# EAGLE board TEC-BVr2 (EAGLE 9.6.2)
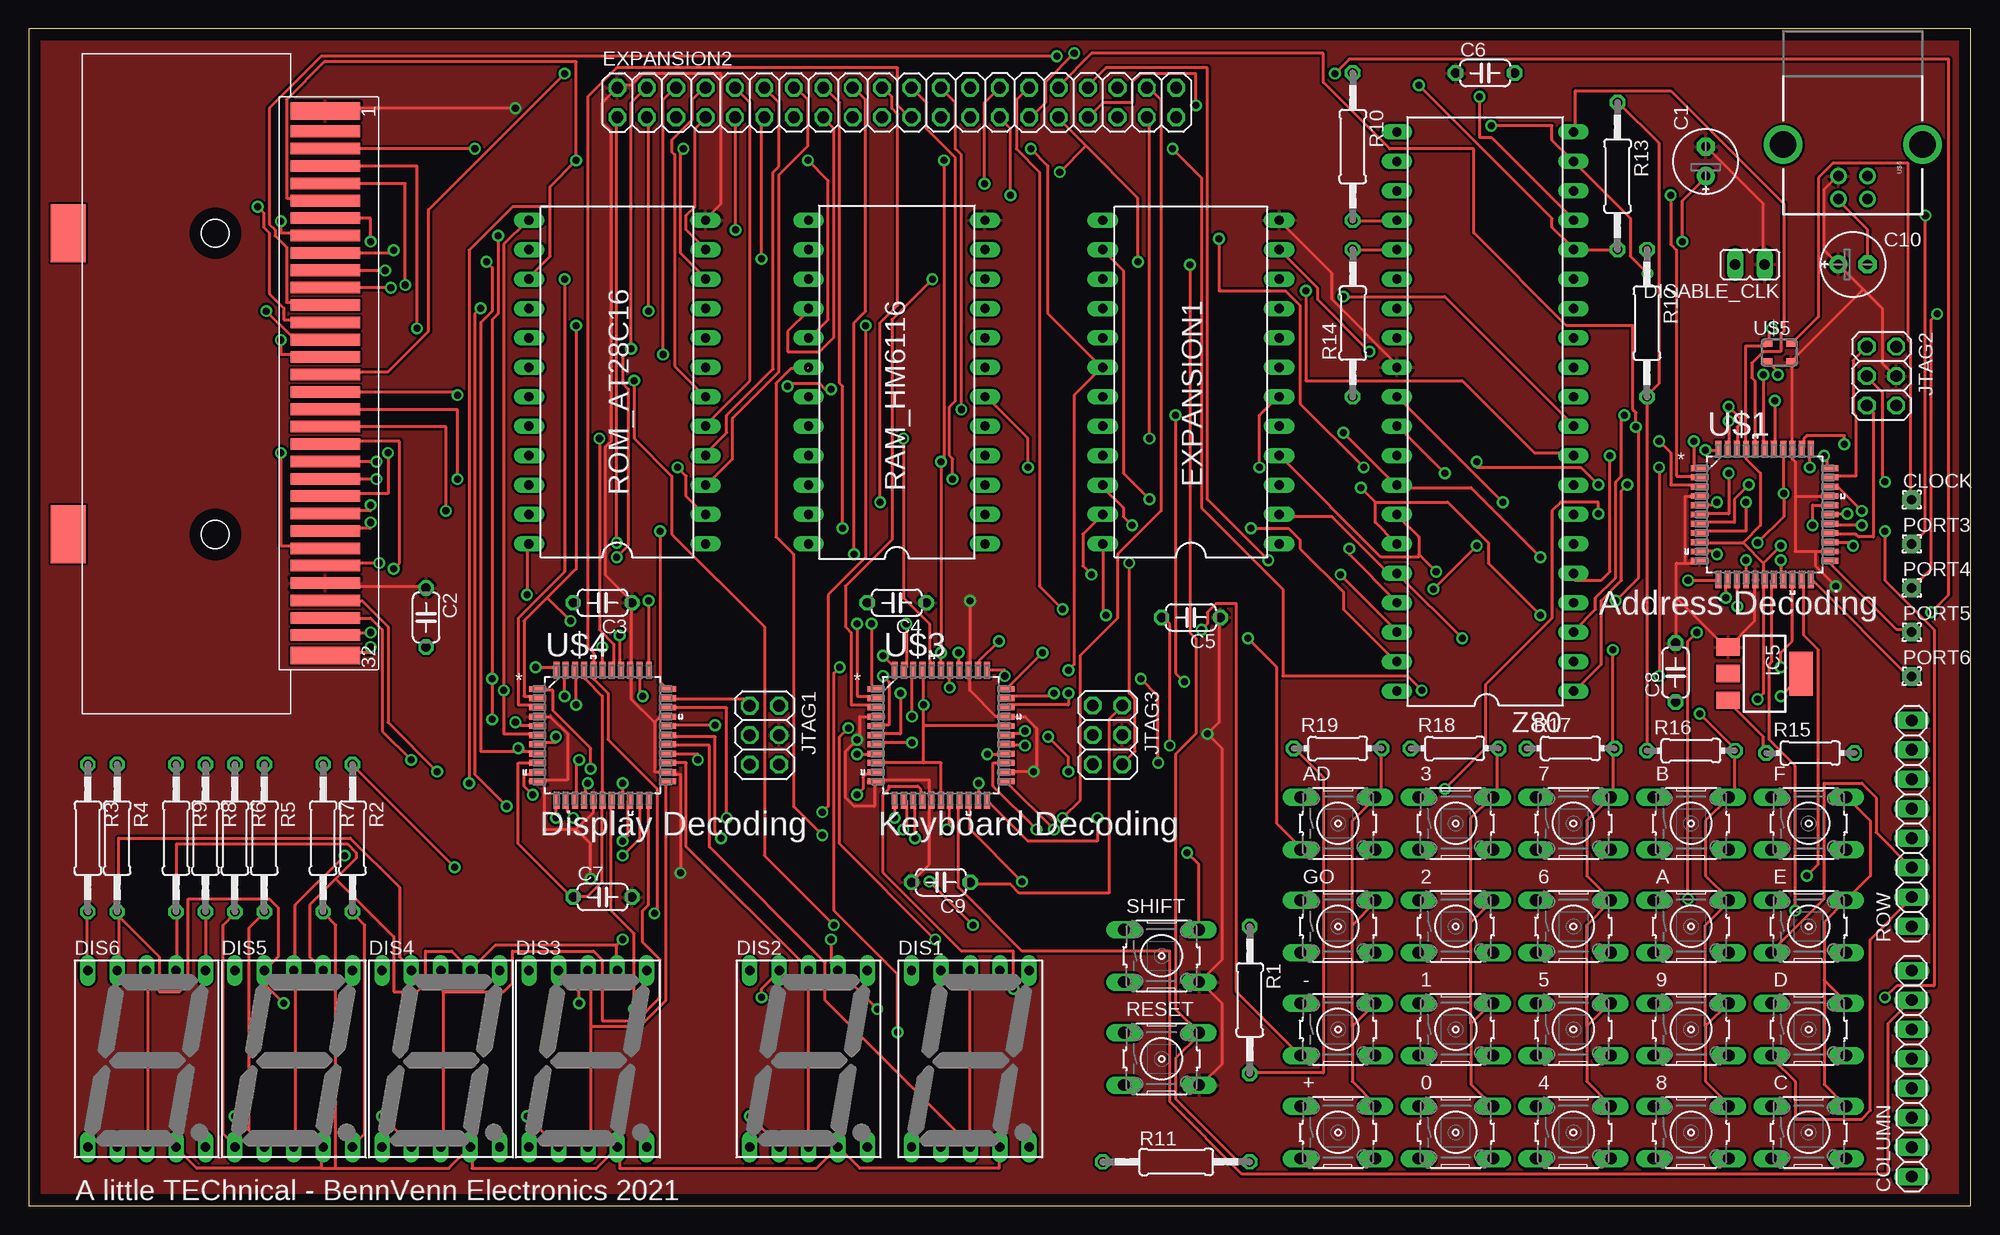
[diagram p2: board, top side]
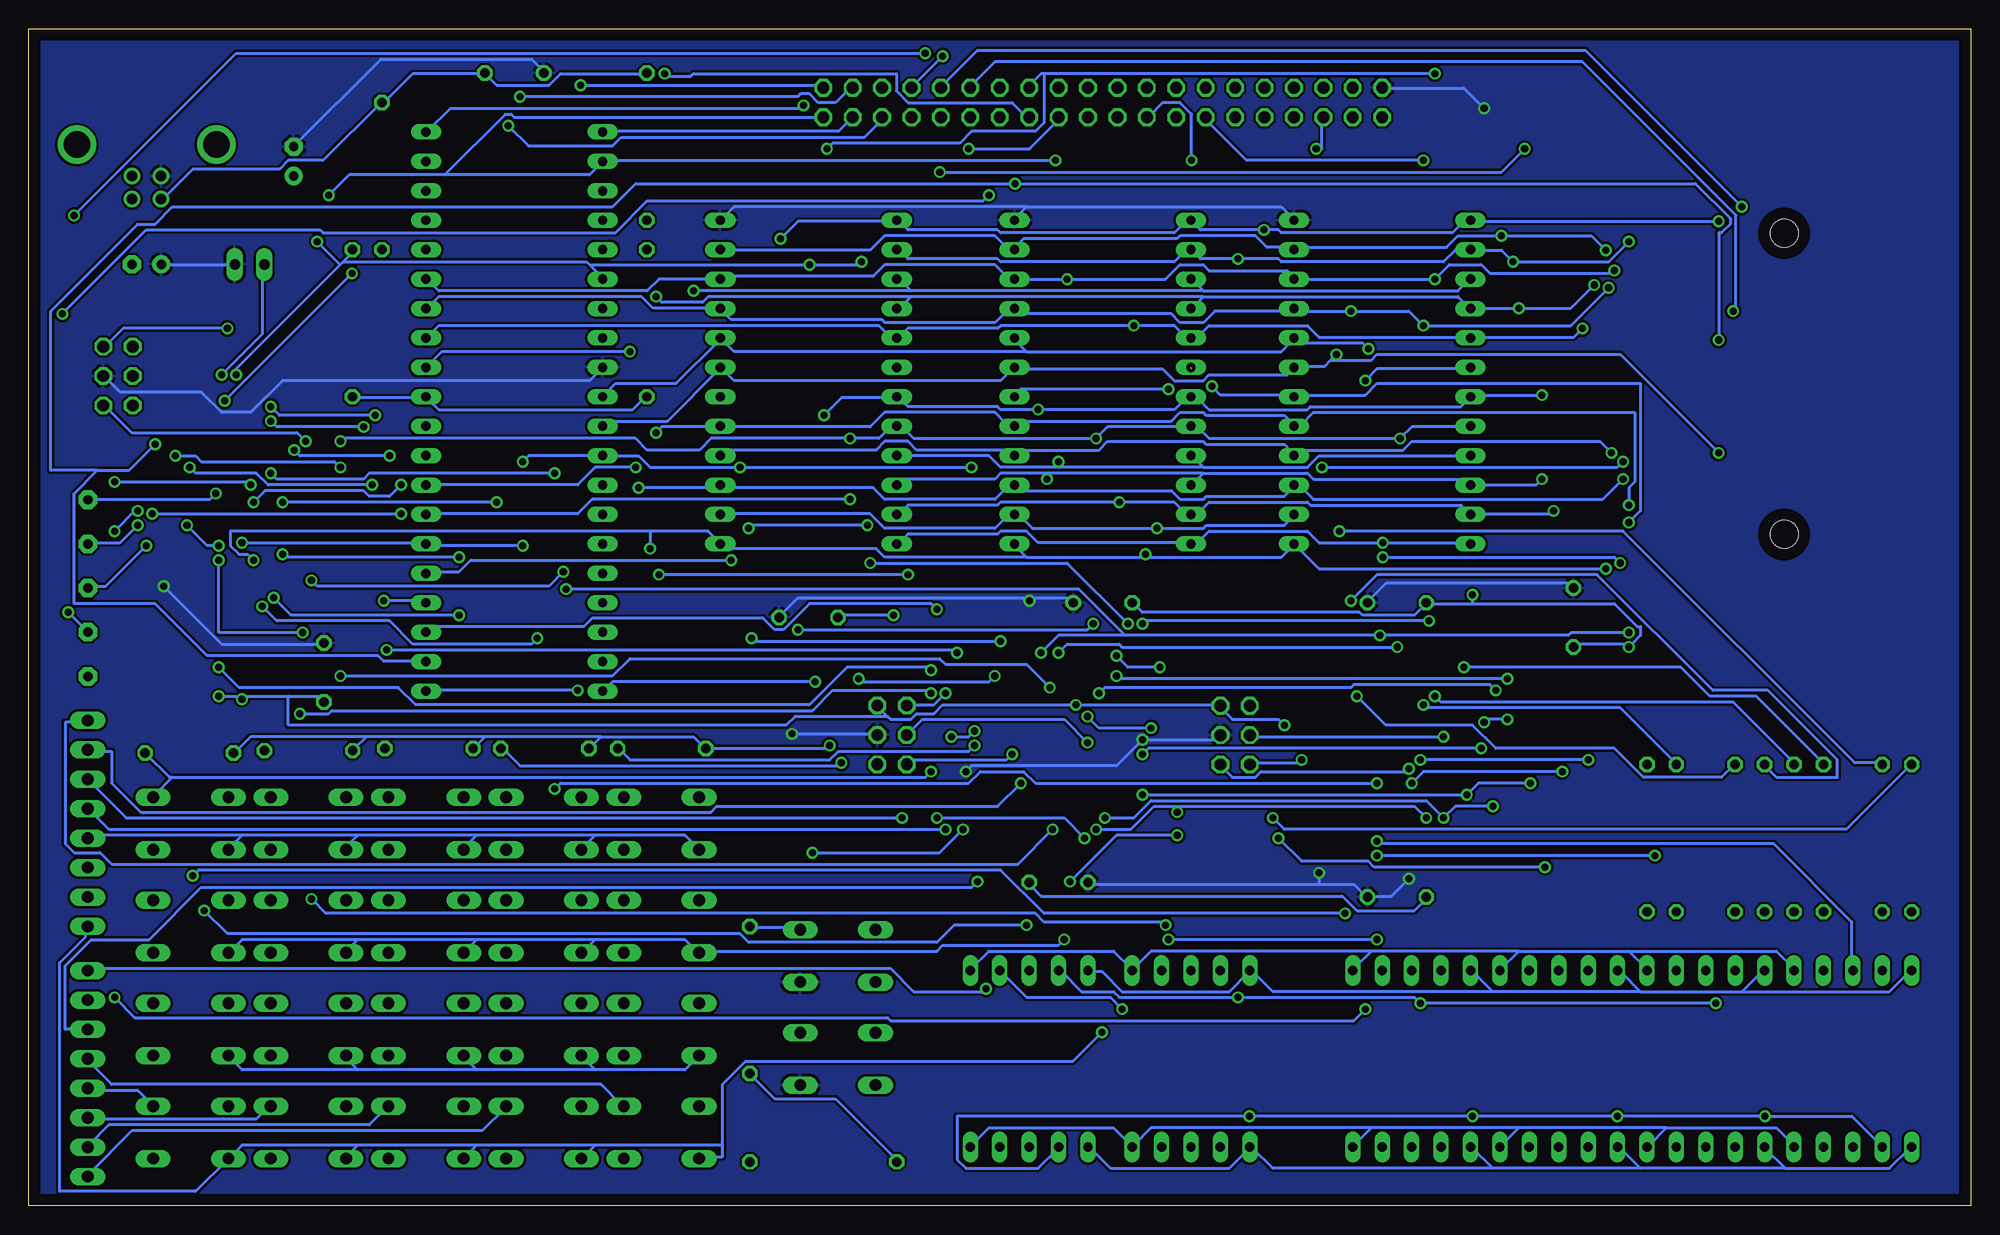
[diagram p3: board, bottom side, seen from below]

Size 167.64 x 101.6 mm. Coordinates in mm from the lower left corner, seen from the top.
Outline: 0,0 167.64,0 167.64,101.6 0,101.6 0,0
Copper layers (1*16): Top 0.035mm / dielectric 1.5mm / Bottom 0.035mm
Design rules "default *": minimum track width 10mil, minimum drill 24mil, track to track 8mil, track to pad 8mil, pad to pad 8mil, via to via 8mil, smd to smd 8mil, copper to edge 40mil, drill to drill 8mil, minimum pad ring 10mil, minimum via ring 8mil, stop-mask expansion 4mil, vias tented up to drill 50mil, thermal gap 10mil

## Footprints (pad centres in the part's own frame; a part is rotated, then mirrored left to right if it is on the bottom)
B3F-10XX = drill 1.016 long: 1 -3.251,2.261; 2 3.251,2.261; 3 -3.251,-2.261; 4 3.251,-2.261
E2,5-6E = drill 0.813 pad 1.575: + -1.27,0 | drill 0.813 pad 1.575 octagon: - 1.27,0
C050-024X044 = drill 0.813 octagon: 1 -2.54,0; 2 2.54,0
1,6/0,8 = drill 0.813 pad 1.6 octagon: 1 0,0
1X08 = drill 1.016 long: 1 -8.89,0; 2 -6.35,0; 3 -3.81,0; 4 -1.27,0; 5 1.27,0; 6 3.81,0; 7 6.35,0; 8 8.89,0
HDSP-M = drill 0.813 long: 1 -5.08,-7.62; 2 -2.54,-7.62; 3 0,-7.62; 4 2.54,-7.62; 5 5.08,-7.62; 6 5.08,7.62; 7 2.54,7.62; 8 0,7.62; 9 -2.54,7.62; 10 -5.08,7.62
JP1 = drill 0.914 long: 1 0,-1.27; 2 0,1.27
DIL24-6 = drill 0.813 long: 1 -13.97,-7.62; 2 -11.43,-7.62; 3 -8.89,-7.62; 4 -6.35,-7.62; 5 -3.81,-7.62; 6 -1.27,-7.62; 7 1.27,-7.62; 8 3.81,-7.62; 9 6.35,-7.62; 10 8.89,-7.62; 11 11.43,-7.62; 12 13.97,-7.62; 13 13.97,7.62; 14 11.43,7.62; 15 8.89,7.62; 16 6.35,7.62; 17 3.81,7.62; 18 1.27,7.62; 19 -1.27,7.62; 20 -3.81,7.62; 21 -6.35,7.62; 22 -8.89,7.62; 23 -11.43,7.62; 24 -13.97,7.62
2X20 = drill 1.016 octagon: 1 -24.13,-1.27; 2 -24.13,1.27; 3 -21.59,-1.27; 4 -21.59,1.27; 5 -19.05,-1.27; 6 -19.05,1.27; 7 -16.51,-1.27; 8 -16.51,1.27; 9 -13.97,-1.27; 10 -13.97,1.27; 11 -11.43,-1.27; 12 -11.43,1.27; 13 -8.89,-1.27; 14 -8.89,1.27; 15 -6.35,-1.27; 16 -6.35,1.27; 17 -3.81,-1.27; 18 -3.81,1.27; 19 -1.27,-1.27; 20 -1.27,1.27; 21 1.27,-1.27; 22 1.27,1.27; 23 3.81,-1.27; 24 3.81,1.27; 25 6.35,-1.27; 26 6.35,1.27; 27 8.89,-1.27; 28 8.89,1.27; 29 11.43,-1.27; 30 11.43,1.27; 31 13.97,-1.27; 32 13.97,1.27; 33 16.51,-1.27; 34 16.51,1.27; 35 19.05,-1.27; 36 19.05,1.27; 37 21.59,-1.27; 38 21.59,1.27; 39 24.13,-1.27; 40 24.13,1.27
SOT223 = smd 1.5 x 2: 1 -2.3,-3.15; 2 0,-3.15; 3 2.3,-3.15 | smd 3.8 x 2: 4 0,3.15
2X03 = drill 1.016 octagon: 1 -2.54,-1.27; 2 -2.54,1.27; 3 0,-1.27; 4 0,1.27; 5 2.54,-1.27; 6 2.54,1.27
0207/12 = drill 0.813 octagon: 1 -6.35,0; 2 6.35,0
0204/7 = drill 0.813 octagon: 1 -3.81,0; 2 3.81,0
DIL24 = drill 0.813 long: 1 -13.97,-7.62; 2 -11.43,-7.62; 3 -8.89,-7.62; 4 -6.35,-7.62; 5 -3.81,-7.62; 6 -1.27,-7.62; 7 1.27,-7.62; 8 3.81,-7.62; 9 6.35,-7.62; 10 8.89,-7.62; 11 11.43,-7.62; 12 13.97,-7.62; 13 13.97,7.62; 14 11.43,7.62; 15 8.89,7.62; 16 6.35,7.62; 17 3.81,7.62; 18 1.27,7.62; 19 -1.27,7.62; 20 -3.81,7.62; 21 -6.35,7.62; 22 -8.89,7.62; 23 -11.43,7.62; 24 -13.97,7.62
QFP80P1200X1200X120-44N = smd 1.473 x 0.508: 1 -5.613,3.988; 2 -5.613,3.2; 3 -5.613,2.388; 4 -5.613,1.6; 5 -5.613,0.787; 6 -5.613,0; 7 -5.613,-0.787; 8 -5.613,-1.6; 9 -5.613,-2.388; 10 -5.613,-3.2; 11 -5.613,-3.988; 23 5.613,-3.988; 24 5.613,-3.2; 25 5.613,-2.388; 26 5.613,-1.6; 27 5.613,-0.787; 28 5.613,0; 29 5.613,0.787; 30 5.613,1.6; 31 5.613,2.388; 32 5.613,3.2; 33 5.613,3.988 | smd 0.508 x 1.473: 12 -3.988,-5.613; 13 -3.2,-5.613; 14 -2.388,-5.613; 15 -1.6,-5.613; 16 -0.787,-5.613; 17 0,-5.613; 18 0.787,-5.613; 19 1.6,-5.613; 20 2.388,-5.613; 21 3.2,-5.613; 22 3.988,-5.613; 34 3.988,5.613; 35 3.2,5.613; 36 2.388,5.613; 37 1.6,5.613; 38 0.787,5.613; 39 0,5.613; 40 -0.787,5.613; 41 -1.6,5.613; 42 -2.388,5.613; 43 -3.2,5.613; 44 -3.988,5.613
GB_CON32 = smd 1.5 x 6: 1 2,4; 32 49,4 | smd 1 x 6: 2 3.75,4; 3 5.25,4; 4 6.75,4; 5 8.25,4; 6 9.75,4; 7 11.25,4; 8 12.75,4; 9 14.25,4; 10 15.75,4; 11 17.25,4; 12 18.75,4; 13 20.25,4; 14 21.75,4; 15 23.25,4; 16 24.75,4; 17 26.25,4; 18 27.75,4; 19 29.25,4; 20 30.75,4; 21 32.25,4; 22 33.75,4; 23 35.25,4; 24 36.75,4; 25 38.25,4; 26 39.75,4; 27 41.25,4; 28 42.75,4; 29 44.25,4; 30 45.75,4; 31 47.25,4 | smd 5 x 3: P$1 12.55,-18.2; P$2 38.55,-18.2 | hole 2.4: 12.55,-5.5; 38.55,-5.5
ASE = smd 0.9 x 0.65: 1 -1.05,-0.825; 2 1.05,-0.825; 3 1.05,0.825; 4 -1.05,0.825
USB_B_PTH = drill 0.914: D+ 0,1.25; D- 1.981,1.25; GND 0,-1.25; VBUS 1.981,-1.25 | drill 2.286: P$1 -2.718,-6.02; P$2 -2.718,6.02
DIL40 = drill 0.813 long: 1 -24.13,-7.62; 2 -21.59,-7.62; 3 -19.05,-7.62; 4 -16.51,-7.62; 5 -13.97,-7.62; 6 -11.43,-7.62; 7 -8.89,-7.62; 8 -6.35,-7.62; 9 -3.81,-7.62; 10 -1.27,-7.62; 11 1.27,-7.62; 12 3.81,-7.62; 13 6.35,-7.62; 14 8.89,-7.62; 15 11.43,-7.62; 16 13.97,-7.62; 17 16.51,-7.62; 18 19.05,-7.62; 19 21.59,-7.62; 20 24.13,-7.62; 21 24.13,7.62; 22 21.59,7.62; 23 19.05,7.62; 24 16.51,7.62; 25 13.97,7.62; 26 11.43,7.62; 27 8.89,7.62; 28 6.35,7.62; 29 3.81,7.62; 30 1.27,7.62; 31 -1.27,7.62; 32 -3.81,7.62; 33 -6.35,7.62; 34 -8.89,7.62; 35 -11.43,7.62; 36 -13.97,7.62; 37 -16.51,7.62; 38 -19.05,7.62; 39 -21.59,7.62; 40 -24.13,7.62

## Placement (x,y rotation side)
0  [B3F-10XX]  123.19,6.35 0 top
1  [B3F-10XX]  123.19,15.24 0 top
2  [B3F-10XX]  123.19,24.13 0 top
3  [B3F-10XX]  123.19,33.02 0 top
4  [B3F-10XX]  133.35,6.35 0 top
5  [B3F-10XX]  133.35,15.24 0 top
6  [B3F-10XX]  133.35,24.13 0 top
7  [B3F-10XX]  133.35,33.02 0 top
8  [B3F-10XX]  143.51,6.35 0 top
9  [B3F-10XX]  143.51,15.24 0 top
+  [B3F-10XX]  113.03,6.35 0 top
-  [B3F-10XX]  113.03,15.24 0 top
A  [B3F-10XX]  143.51,24.13 0 top
AD  [B3F-10XX]  113.03,33.02 0 top
B  [B3F-10XX]  143.51,33.02 0 top
C  [B3F-10XX]  153.67,6.35 0 top
C1  [E2,5-6E]  144.78,90.17 90 top
C2  [C050-024X044]  34.29,50.8 270 top
C3  [C050-024X044]  49.53,52.07 180 top
C4  [C050-024X044]  74.93,52.07 180 top
C5  [C050-024X044]  100.33,50.8 180 top
C6  [C050-024X044]  125.73,97.79 0 top
C7  [C050-024X044]  49.53,26.67 0 top
C8  [C050-024X044]  142.17,46.05 90 top
C9  [C050-024X044]  78.74,27.94 180 top
C10  [E2,5-6E]  157.48,81.28 0 top
CLOCK  [1,6/0,8]  162.56,60.96 0 top
COLUMN  [1X08]  162.56,11.43 90 top
D  [B3F-10XX]  153.67,15.24 0 top
DIS1  HD-H103  [HDSP-M]  81.28,12.7 0 top
DIS2  HD-H103  [HDSP-M]  67.31,12.7 0 top
DIS3  HD-H103  [HDSP-M]  48.26,12.7 0 top
DIS4  HD-H103  [HDSP-M]  35.56,12.7 0 top
DIS5  HD-H103  [HDSP-M]  22.86,12.7 0 top
DIS6  HD-H103  [HDSP-M]  10.16,12.7 0 top
DISABLE_CLK  [JP1]  148.59,81.28 90 top
E  [B3F-10XX]  153.67,24.13 0 top
EXPANSION1  [DIL24-6]  100.33,71.12 90 top
EXPANSION2  [2X20]  74.93,95.25 0 top
F  [B3F-10XX]  153.67,33.02 0 top
GO  [B3F-10XX]  113.03,24.13 0 top
IC5  LD117AS33TR  [SOT223]  149.86,45.95 270 top
JTAG1  [2X03]  63.5,40.64 270 top
JTAG2  [2X03]  159.95,71.64 270 top
JTAG3  [2X03]  93.12,40.66 270 top
PORT3  [1,6/0,8]  162.56,57.15 0 top
PORT4  [1,6/0,8]  162.56,53.34 0 top
PORT5  [1,6/0,8]  162.56,49.53 0 top
PORT6  [1,6/0,8]  162.56,45.72 0 top
R1  [0207/12]  105.41,17.78 270 top
R2  [0207/12]  27.94,31.75 270 top
R3  [0207/12]  5.08,31.75 270 top
R4  [0207/12]  7.62,31.75 270 top
R5  [0207/12]  20.32,31.75 270 top
R6  [0207/12]  17.78,31.75 270 top
R7  [0207/12]  25.4,31.75 270 top
R8  [0207/12]  15.24,31.75 270 top
R9  [0207/12]  12.7,31.75 270 top
R10  [0207/12]  114.3,91.44 270 top
R11  [0207/12]  99.06,3.81 0 top
R12  [0207/12]  139.7,76.2 270 top
R13  [0207/12]  137.16,88.9 270 top
R14  [0207/12]  114.3,76.2 90 top
R15  [0204/7]  153.8,39.1 0 top
R16  [0204/7]  143.5,39.3 0 top
R17  [0204/7]  133.1,39.5 0 top
R18  [0204/7]  123.1,39.5 0 top
R19  [0204/7]  113,39.5 0 top
RAM_HM6116  [DIL24]  74.93,71.12 90 top
RESET  [B3F-10XX]  97.79,12.7 0 top
ROM_AT28C16  [DIL24-6]  50.8,71.12 90 top
ROW  [1X08]  162.56,33.02 90 top
SHIFT  [B3F-10XX]  97.79,21.59 0 top
U$1  Address Decoding  [QFP80P1200X1200X120-44N]  149.86,59.69 0 top
U$2  GBCON32FLIP  [GB_CON32]  21.59,96.52 270 top
U$3  Keyboard Decoding  [QFP80P1200X1200X120-44N]  78.74,40.64 0 top
U$4  Display Decoding  [QFP80P1200X1200X120-44N]  49.53,40.64 0 top
U$5  ASE  [ASE]  151.13,73.66 0 top
U$6  USB  [USB_B_PTH]  157.48,88.9 270 top
Z80  [DIL40]  125.73,68.58 90 top

## Tracks (layer width: path | path; a pad name or v marks a point on that pad's centre or on a via)
3V3  (via drill 0.61)
  Top 0.254: v151.25,44 153,45.75 IC5.4 | 149.75,55.5 149.75,54.25 U$1.17 149.75,54 149.75,44.25 v149.25,43.75 | 148,57.25 149.75,55.5 | 148,57.25 144.25,57.25 U$1.9 | v154,58.75 154,60.5 155.25,60.5 U$1.29 | 149.75,55.5 v151.25,57 | v150.5,75.75 150.25,75.5 150.25,74.5 U$5.4 150,74.25 148.25,74.25 148.25,65.5 U$1.41 148.25,65.25 148.25,64.5 149.5,63.25 149.5,58.75 148,57.25 | U$4.41 48,46.25 48,45.5 49.5,44 49.5,35.25 U$4.17 49.5,35 49.5,28 48.25,26.75 47,26.75 C7.1 46.75,26.75 42.25,31.25 42.25,38.25 43.75,38.25 U$4.9 | 77.25,38.25 78.75,38.25 78.75,35.25 U$3.17 | 77.25,38.25 73.25,38.25 U$3.9 | 77.25,38.25 77.25,41.5 | 77.25,41.5 v77.25,43.25 77.25,46.25 U$3.41 | 77.25,41.5 84.25,41.5 U$3.29 | v59.25,41.5 55.25,41.5 U$4.29 | C9.1 81.5,27.75 84.75,27.75 85.5,27 93.25,27 93.25,42 94.25,43 JTAG3.2
  Bottom 0.254: v151.25,44 149.25,44 | 149.25,44 145.25,44 | 145.25,44 142.5,44 142.25,43.75 C8.1 | v154,58.75 152.25,57 v151.25,57 | v150.5,75.75 159.5,75.75 161,74.25 JTAG2.2 | v149.25,43.75 149.25,44 | v59.25,41.5 59.75,42 63.75,42 64.75,43 JTAG1.2 65,43.25 v77.25,43.25 88.75,43.25 89.5,42.5 91,42.5 91.5,42 93.25,42 93.5,42.25 | 93.5,42.25 94.25,43 JTAG3.2 | C7.1 47,26.5 48,25.5 53,25.5 54.25,26.75 80.25,26.75 81.25,27.75 C9.1 | 145.25,44 145.25,41.5 102.25,41.5 101.5,42.25 93.5,42.25
!INT  (via drill 0.61)
  Top 0.254: R13.2 137,82.5 133.5,82.5 Z80.16 133.25,82.75 131.5,84.5 131.5,85.25 v120,96.75
  Bottom 0.254: v120,96.75 99.25,96.75 EXPANSION2.40
!RD  (via drill 0.61)
  Top 0.254: v49.25,66.25 49.25,49.75 50.5,48.5 50.5,46.5 U$4.38 | v75.5,66.25 75.5,52.5 77.75,50.25 77.75,46.5 U$3.40 | v140.75,66 141.75,65 141.75,62.25 144,62.25 U$1.3 | v96.75,66.25 96.75,93.75 EXPANSION2.37
  Bottom 0.254: ROM_AT28C16.20 43.25,67.25 48.25,67.25 v49.25,66.25 65.75,66.25 66.75,67.25 67.25,67.25 RAM_HM6116.20 67.5,67.25 74.5,67.25 v75.5,66.25 91.25,66.25 92.25,67.25 92.5,67.25 EXPANSION1.20 92.75,67.25 93.25,67.25 94.25,66.25 v96.75,66.25 108.75,66.25 109.75,65.25 114.25,65.25 115.25,66.25 140.5,66.25 v140.75,66 | EXPANSION2.37 97.75,92.75 118,92.75 Z80.21
!RESET  (via drill 0.61)
  Top 0.254: R11.2 105.25,4 104.25,4 99,9.25 99,12.75 101,14.75 RESET.2 101,15 99,17 99,39 100.75,40.75 100.75,49 100.25,49.5 v100.25,81.25 | v149.75,71.75 149.75,65.5 U$1.39 | 91.25,91.5 95.75,87 v95.75,81.5 | 91.25,91.5 89,93.75 EXPANSION2.31 | v142.75,83.25 142.75,86.75 144.75,88.75 C1.+ | v38.5,91.25 25.75,91.25 U$2.3 | 91.25,91.5 v89,89.25
  Bottom 0.254: v149.75,71.75 149.75,72.25 140.75,81.25 | 140.5,81.5 139.5,82.5 R12.1 | 140.5,81.5 140.75,81.25 | 119.25,81.25 119.5,81.5 140.5,81.5 | 119.25,81.25 118.25,80.25 Z80.26 | v95.75,81.5 96,81.25 v100.25,81.25 119.25,81.25 | 140.75,81.25 v142.75,83.25 | v38.5,91.25 40.5,89.25 v89,89.25
!WR  (via drill 0.61)
  Top 0.254: v49.5,48.25 49.5,46.5 U$4.39 | U$3.39 78.75,46.5 v78.75,47.75 v78.75,64.25 79,64.5 v79,90.25 | v141.75,87.25 141.75,83 142.25,82.5 142.25,63 144,63 U$1.2
  Bottom 0.254: v49.5,48.25 73.25,48.25 73.5,48.5 78,48.5 v78.75,47.75 | 66.25,63.75 57.25,63.75 56.25,64.75 43.25,64.75 ROM_AT28C16.21 | 66.25,63.75 67.25,64.75 RAM_HM6116.21 | 66.25,63.75 78.75,63.75 | 78.75,63.75 83.75,63.75 84.75,64.75 92.5,64.75 EXPANSION1.21 | 78.75,63.75 v78.75,64.25 | v141.75,87.25 140,89 131.75,89 | 131.75,89 119.25,89 118.25,90 Z80.22 118,90.25 v79,90.25 | 131.75,89 126.5,94.25 126,94.25 125.75,94 99.25,94 EXPANSION2.39
A  (via drill 0.61)
  Top 0.254: v73.25,17 70,20.25 DIS2.7 69.75,20.5 69.25,21 v69.25,23 | 50.75,22.5 40.25,22.5 38.25,20.5 DIS4.7 38,20.5 36.5,22 34.25,22 34.25,19.25 33.5,18.5 31.5,18.5 31.5,23.25 26.5,28.25 | 50.75,22.5 50.75,20.5 DIS3.7 | DIS6.7 12.75,20.5 12.75,25.25 R9.2 12.75,25.5 12.75,31.25 27.5,31.25 28.25,30.5 28.25,30 26.5,28.25 | 26.5,28.25 24.25,26 24.25,21.5 25.25,20.5 DIS5.7 | 50.75,22.5 v51.25,23
  Bottom 0.254: v73.25,17 74.25,18 81.5,18 DIS1.7 | v51.25,23 v69.25,23
A0  (via drill 0.61)
  Top 0.254: v145.75,60.75 145.75,60.5 144.25,60.5 U$1.5 | v127.25,60.75 118.25,69.75 Z80.30 | EXPANSION2.4 53.25,96.5 52,95.25 v52,74 51.25,73.25 51.25,71 51.75,70.5 51.75,57 v50.75,56 | v30.25,55.5 25.75,55.5 U$2.27
  Bottom 0.254: v127.25,60.75 v145.75,60.75 | Z80.30 118,70 117,71 111.75,71 108,74.75 EXPANSION1.8 107.75,74.75 106.75,73.75 81.5,73.75 | 58.75,74.5 59.5,73.75 81.5,73.75 | 58.75,74.5 58.5,74.75 ROM_AT28C16.8 58.75,74.5 | 81.5,73.75 82.5,74.75 RAM_HM6116.8 | v52,74 52.5,74.5 58.75,74.5 | v30.25,55.5 30.75,56 v50.75,56
A1  (via drill 0.61)
  Top 0.254: v146.75,63.25 146.75,59.75 144.25,59.75 U$1.6 | v122.25,63.25 118.25,67.25 Z80.31 | v54.75,73.5 54.75,95.5 55.75,96.5 EXPANSION2.6 | v21.75,65 21.75,57 25.5,57 U$2.26
  Bottom 0.254: v146.75,63.25 146.25,62.75 138.75,62.75 138.25,63.25 v122.25,63.25 | Z80.31 118,67.5 117.75,67.75 112.5,67.75 108,72.25 EXPANSION1.7 107.75,72.25 106.75,71.25 83.75,71.25 82.75,72.25 RAM_HM6116.7 82.5,72.25 69.75,72.25 68.75,71.25 66.25,71.25 65.75,71.75 59,71.75 58.5,72.25 ROM_AT28C16.7 58.25,72.5 55.75,72.5 55.25,73 | 55.25,73 v54.75,73.5 | v21.75,65 30.25,73.5 51.25,73.5 51.75,73 55.25,73
A2  (via drill 0.61)
  Top 0.254: v148.25,60.75 148.25,58.25 144.25,58.25 U$1.8 | v135.5,62.25 134,63.75 125,63.75 v125,64.25 | v86.25,63.75 86.25,66.25 82.75,69.75 RAM_HM6116.6 | v106.25,63.75 106.25,68.25 107.75,69.75 EXPANSION1.6 | ROM_AT28C16.6 58.25,70 55.75,72.5 55.75,90.75 55.5,91 55.5,92 57.25,93.75 57.25,95.5 58.25,96.5 EXPANSION2.8 | v29.5,59 29.5,58.5 25.75,58.5 U$2.25 | v69.25,70.5 68.75,70.5 68.25,71 65.5,71 v65.5,70.75
  Bottom 0.254: v148.25,60.75 147.25,61.75 138.75,61.75 138.25,61.25 136.5,61.25 v135.5,62.25 | v125,64.25 124.5,64.75 118.25,64.75 Z80.32 118,64.75 115,64.75 114,63.75 v106.25,63.75 v86.25,63.75 | v29.5,59 28.5,60 28.5,71 51.25,71 52.25,70 58.25,70 ROM_AT28C16.6 58.5,70 64.75,70 v65.5,70.75 | v69.25,70.5 82,70.5 82.5,70 RAM_HM6116.6
A3  (via drill 0.61)
  Top 0.254: v145.75,56.25 145.75,56.5 U$1.10 | v130.5,56 124.5,62 118.25,62 Z80.33 118,62.25 v113.5,66.75 | EXPANSION2.10 61,96.5 62.25,95.25 62.25,71.25 58.5,67.5 ROM_AT28C16.5 | v29.5,60.5 29.5,60 25.75,60 U$2.24
  Bottom 0.254: v145.75,56.25 145.5,56 v130.5,56 | v29.5,60.5 29.5,62 29,62.5 29,68.5 56.75,68.5 57.75,67.5 58.25,67.5 ROM_AT28C16.5 58.5,67.5 59.25,68.25 66,68.25 66.25,68.5 68.25,68.5 69,67.75 82.25,67.75 82.5,67.5 RAM_HM6116.5 82.75,67.5 83.25,67.5 84.25,68.5 93.75,68.5 95,67.25 107.75,67.25 EXPANSION1.5 108,67.25 113,67.25 v113.5,66.75
A4  (via drill 0.61)
  Top 0.254: v143.25,54 145.75,54 U$1.12 | 120,56.25 v121.5,54.75 | 120,56.25 120,57.75 118.25,59.5 Z80.34 | 120,56.25 120,56 116.75,56 108,64.75 EXPANSION1.4 | EXPANSION2.12 63.5,96.5 64.75,95.25 64.75,89.75 64.25,89.25 64.25,72.25 60.25,68.25 60.25,66.75 58.5,65 ROM_AT28C16.4 | v31,65 31,61.5 25.75,61.5 U$2.23
  Bottom 0.254: v143.25,54 142.75,53.5 122.75,53.5 v121.5,54.75 | 58.75,65.25 59.25,65.75 66,65.75 66.25,66 74.5,66 75.25,65.25 82.25,65.25 | 58.75,65.25 58.5,65 ROM_AT28C16.4 58.75,65.25 | 82.25,65.25 82.5,65 RAM_HM6116.4 82.25,65.25 | v31,65 32,66 48.25,66 49,65.25 58.75,65.25 | 82.25,65.25 91,65.25 91.75,66 93.75,66 94.5,65.25 107.5,65.25 107.75,65 EXPANSION1.4
A5  (via drill 0.61)
  Top 0.254: v146.5,52.5 146.5,54 U$1.13 | v130.5,51 126,55.5 126,57.25 122.5,60.75 116.25,60.75 | 116.25,60.75 116.25,59 118,57.25 Z80.35 | EXPANSION2.14 66.25,96.5 67.25,95.5 67.25,91.5 64.75,89 64.75,72 60.75,68 60.75,64.5 58.5,62.25 ROM_AT28C16.3 | v30,62.75 25.75,62.75 U$2.22 | v115,62 116.25,60.75
  Bottom 0.254: v146.5,52.5 145,51 v130.5,51 | v30,62.75 31.75,61 56.75,61 57.75,62 58.25,62 ROM_AT28C16.3 58.5,62 59.25,61.25 66,61.25 66.25,61 68.25,61 69,61.75 82.25,61.75 82.5,62 RAM_HM6116.3 82.75,62 83.25,62 84.25,61 93.75,61 94.75,62 107.75,62 EXPANSION1.3 108,62 v115,62
A6  (via drill 0.61)
  Top 0.254: v147.5,51.75 147.5,54 U$1.14 | v123.75,49 118.25,54.5 Z80.36 118,54.75 117.25,54.75 112.5,59.5 108,59.5 EXPANSION1.2 | v70.25,58.5 70.25,70.75 70,71 70,95.25 68.75,96.5 EXPANSION2.16 | v30,64.25 25.75,64.25 U$2.21 | v56,63.75 56.75,63 56.75,61.25 58.25,59.75 ROM_AT28C16.2
  Bottom 0.254: v147.5,51.75 146.25,50.5 136.5,50.5 134.5,48.5 124.25,48.5 v123.75,49 | ROM_AT28C16.2 58.5,59.5 59.25,58.75 66,58.75 66.25,58.5 v70.25,58.5 81,58.5 82,59.5 82.5,59.5 RAM_HM6116.2 82.75,59.5 83.25,59.5 84.25,58.5 93.75,58.5 95,59.75 107.75,59.75 EXPANSION1.2 | v30,64.25 30.5,63.75 v56,63.75
A7  (via drill 0.61)
  Top 0.254: v148.25,55.75 148.25,54.25 U$1.15 | v114,56.75 114,56.25 118,52.25 Z80.37 | v71.25,56.25 71.25,76.25 72.25,77.25 72.25,95.5 71.25,96.5 EXPANSION2.18 | v31.5,55 32,55.5 32,66 25.75,66 U$2.20
  Bottom 0.254: v148.25,55.75 148.75,56.25 149.5,56.25 150.25,57 150.25,58.25 114,58.25 | 114,58.25 109,58.25 108,57.25 EXPANSION1.1 107.75,57 107.5,56.75 94.5,56.75 93.75,56 81.5,56 | 114,58.25 v114,56.75 | 81.5,56 71.25,56 | 71.25,56 59.5,56 58.5,57 ROM_AT28C16.1 58.25,57 56.25,55 v31.5,55 | 81.5,56 82.5,57 RAM_HM6116.1 | 71.25,56 v71.25,56.25
A8  (via drill 0.61)
  Top 0.254: v113.25,54.5 118,49.75 Z80.38 | v91.75,54.5 91,55.25 91,58 92.5,59.5 EXPANSION1.23 | v73.5,60.75 73.5,76.25 75,77.75 75,94.25 74.5,94.75 74.5,95.75 73.75,96.5 EXPANSION2.20 | v36,60 36,67.25 25.75,67.25 U$2.19
  Bottom 0.254: EXPANSION1.23 92.5,59.75 91.75,60.5 84,60.5 83.75,60.75 v73.5,60.75 68.75,60.75 67.75,59.75 67.5,59.75 RAM_HM6116.23 67.25,59.75 66.75,59.75 65.75,60.75 57.25,60.75 57,60.5 44,60.5 43.25,59.75 ROM_AT28C16.23 43,59.75 36.25,59.75 v36,60 | v91.75,54.5 v113.25,54.5
A9  (via drill 0.61)
  Top 0.254: v105.5,58.5 108.75,58.5 109.75,57.5 109.75,56.75 113.5,53 113.5,51.5 118,47 Z80.39 | v95.25,58.75 94.5,59.5 94.5,60.25 92.75,62 EXPANSION1.22 | v79.75,62.75 79.75,64.5 79.5,64.75 79.5,69 80,69.5 80,90.5 77.5,93 77.5,95.25 76.25,96.5 EXPANSION2.22 | v37,62.75 37,68.75 25.75,68.75 U$2.18
  Bottom 0.254: 66.25,63.25 57.25,63.25 56.75,62.75 43.75,62.75 43.25,62.25 ROM_AT28C16.22 43,62.25 37.5,62.25 v37,62.75 | 66.25,63.25 67.25,62.25 RAM_HM6116.22 | 66.25,63.25 79.75,63.25 | 79.75,63.25 83.75,63.25 84.25,62.75 92,62.75 92.5,62.25 EXPANSION1.22 | v105.5,58.5 105.25,58.75 v95.25,58.75 | 79.75,63.25 v79.75,62.75
A10  (via drill 0.61)
  Top 0.254: v99.75,45.25 99,46 v99,68.25 | v80.5,68.75 80.5,90.75 80,91.25 80,95.25 78.75,96.5 EXPANSION2.24 | v37,70 37,70.25 25.75,70.25 U$2.17
  Bottom 0.254: v99.75,45.25 117.25,45.25 118,44.5 Z80.40 | v99,68.25 97.5,69.75 92.75,69.75 EXPANSION1.19 92.5,69.75 91.75,69 84,69 83.75,68.75 v80.5,68.75 68.75,68.75 67.75,69.75 67.5,69.75 RAM_HM6116.19 67.25,69.75 66.75,69.75 65.75,68.75 57.25,68.75 57,69 44,69 43.25,69.75 ROM_AT28C16.19 43,70 v37,70
A11  (via drill 0.61)
  Top 0.254: v153.75,63.75 153.75,65.25 U$1.34 | v138,62.25 137.5,61.75 137.5,54 135.75,52.25 135.75,46.75 133.5,44.5 Z80.1 | v46.25,97.75 34.5,86 34.5,75.5 31,72 25.75,72 U$2.16 | v120.25,44.5 119,45.75 108.25,45.75 108.25,53.25 101.25,60.25 101.25,88.75 v98.75,91.25
  Bottom 0.254: v153.75,63.75 153.25,63.25 148,63.25 147,62.25 v138,62.25 | v46.25,97.75 80,97.75 | 80,97.75 80.25,97.75 81.25,96.75 EXPANSION2.26 | v120.25,44.5 133.25,44.5 Z80.1 | v98.75,91.25 98.25,91.75 87.25,91.75 86.25,92.75 80.75,92.75 80,93.5 80,97.75
A12  (via drill 0.61)
  Top 0.254: v156.75,65.75 156.75,66.5 153.5,66.5 153.25,66.25 153.25,65.5 U$1.35 | v82.5,88.25 82.5,95.25 83.75,96.5 EXPANSION2.28 | v21.75,74.75 21.75,73.5 25.5,73.5 U$2.15
  Bottom 0.254: v156.75,65.75 159,63.5 161.75,63.5 | 161.75,63.5 163.75,61.5 163.75,52 156.75,52 152.25,47.5 137.5,47.5 137,47 133.5,47 Z80.2 | 161.75,63.5 165.75,63.5 165.75,77.25 158.25,84.75 156.75,84.75 155.25,86.25 117.25,86.25 115.25,88.25 v82.5,88.25 23.75,88.25 20.75,85.25 20.75,84.75 21.5,84 21.75,84 v21.75,74.75
A13  (via drill 0.61)
  Top 0.254: v146.75,69 147.75,68 147.75,67.5 147.5,67.25 147.5,65.5 U$1.42 | v137.75,68.25 137.5,68 137.5,63 137,62.5 137,54.25 135.25,52.5 135.25,51.5 133.5,49.75 Z80.3 | v20.5,77.25 22.75,75 25.5,75 U$2.14 | v89.25,51.5 87.25,53.5 87.25,89.25 85.25,91.25 85.25,95.5 86.25,96.5 EXPANSION2.30
  Bottom 0.254: v146.75,69 146,68.25 v137.75,68.25 | v20.5,77.25 20.25,77.25 20.25,85.5 33.5,98.75 84.25,98.75 86.25,96.75 EXPANSION2.30 | v89.25,51.5 89.75,52 100.25,52 102.5,49.75 103.25,49.75 104.25,50.75 119,50.75 119.75,50 133,50 133.25,49.75 Z80.3
A14  (via drill 0.61)
  Top 0.254: v146.75,67.75 146.75,65.5 U$1.43 | v137,52.25 139,54.25 139,67 v138.75,67.25 138.75,68.5 138.5,68.75 138.5,76 132.75,76 124.75,84 124.75,91.25 117.5,91.25 111.75,97 111.75,99.5 91.75,99.5 89,96.75 EXPANSION2.32 | v19.75,86.25 20.25,85.75 20.25,84.5 20.75,84 20.75,78.75 22,77.5 22,76.5 25.5,76.5 U$2.13
  Bottom 0.254: v146.75,67.75 146.25,67.25 v138.75,67.25 | v137,52.25 133.5,52.25 Z80.4 | v19.75,86.25 33.25,99.75 85.75,99.75 88.75,96.75 EXPANSION2.32
A15  (via drill 0.61)
  Top 0.254: v144.75,65.25 145.75,65.25 U$1.44 | v136.5,64.75 136.5,54.75 135.75,54 133.5,54 133.5,54.5 Z80.5 | v107,55.75 101.75,61 101.75,98.25 93,98.25 91.5,96.75 EXPANSION2.34 | v88.75,99.25 25.25,99.25 20.75,94.75 20.75,84.75 21.25,84.25 21.25,83.75 22.25,82.75 22.25,78 25.5,78 U$2.12
  Bottom 0.254: v144.75,65.25 144.25,64.75 v136.5,64.75 | v107,55.75 129.5,55.75 130.5,54.75 133.25,54.75 Z80.5 | v88.75,99.25 91.25,96.75 EXPANSION2.34
B
  Top 0.254: DIS6.6 15.25,20.5 15.25,25.25 R8.2
  Bottom 0.254: DIS1.6 86.25,20.5 84.75,22 74,22 72.5,20.5 DIS2.6 72.25,20.5 70.75,22 51.75,22 | 29.5,22 28,20.5 DIS5.6 | 39,22 29.5,22 | 39,22 40.5,20.5 DIS4.6 | 51.75,22 53.25,20.5 DIS3.6 | 39,22 51.75,22 | 29.5,22 16.75,22 15.25,20.5 DIS6.6
BUSRQ
  Top 0.254: R14.2 114.5,82.5 118,82.5 Z80.25
C
  Top 0.254: DIS1.4 83.75,5 83.75,3.25 71.75,3.25 70,5 DIS2.4 69.75,5 68,3.25 51,3.25 51,5 DIS3.4 50.75,5 49,3.25 38.25,3.25 38.25,5 DIS4.4 38,5 36.25,3.25 26.5,3.25 | 25.25,3.25 14.5,3.25 12.75,5 DIS6.4 | 25.25,3.25 25.25,5 DIS5.4 | 25.25,3.25 26.5,3.25 | 26.5,3.25 26.5,24.25 25.5,25.25 R7.2
CART!CS  (via drill 0.61)
  Top 0.254: EXPANSION2.21 76,94 75,95 75,98.25 50.75,98.25 48.25,95.75 48.25,48.25 48.75,47.75 48.75,46.5 U$4.40 48.75,45.5 50,44.25 50,40.25 54.25,36 54.25,25.5 v54,25.25 | v153.5,28.5 154.5,29.5 154.5,48 153.25,49.25 153.25,54 U$1.21
  Bottom 0.254: v153.5,28.5 153,29 83.75,29 80,25.25 v54,25.25
CART!RD  (via drill 0.61)
  Top 0.254: v48.25,36.5 48,36.25 48,35.25 U$4.15 | v35.25,37.5 31,41.75 31,50 28.75,52.25 25.75,52.25 U$2.29
  Bottom 0.254: v48.25,36.5 47.25,37.5 v35.25,37.5
CART!WR  (via drill 0.61)
  Top 0.254: v47.5,38.5 47.25,38.25 47.25,35.25 U$4.14 | v33,38.5 30.5,41 30.5,49.75 29.5,50.75 25.75,50.75 U$2.30
  Bottom 0.254: v33,38.5 v47.5,38.5
CLK  (via drill 0.61)
  Top 0.254: U$5.3 152.25,74.5 154.5,76.75 154.5,88.75 155.75,90 162.25,90 162.25,74.75 162.5,74.5 162.5,61 CLOCK.1 | U$1.37 151.5,65.25 v151.5,61.5 151.5,59.5 v149.25,57.25 | v51,49.25 51,46.5 U$4.37 | v29.5,49.5 25.75,49.5 U$2.31 | v80.25,47.75 80.25,46.5 U$3.37 | v121.25,53.25 v125,57
  Bottom 0.254: v151.5,61.5 152,61 162.5,61 CLOCK.1 | v149.25,57.25 133.5,57.25 Z80.6 133.25,57 v125,57 | v29.5,49.5 34.5,49.5 34.75,49.25 v51,49.25 73,49.25 | v80.25,47.75 78.75,49.25 73,49.25 | v121.25,53.25 77,53.25 73,49.25
D  (via drill 0.61)
  Top 0.254: 19,6.5 20.25,5.25 DIS5.2 | 19,6.5 v17.75,7.75 | v30.5,7.75 33,5.25 DIS4.2 | v43,7.75 45.5,5.25 DIS3.2 | v62.25,7.75 64.75,5.25 DIS2.2 | 19,6.5 19,24 20.25,25.25 R5.2
  Bottom 0.254: DIS6.2 7.75,5.25 10.25,7.75 v17.75,7.75 v30.5,7.75 v43,7.75 v62.25,7.75 87.5,7.75 87.5,4 86.75,3.25 80.5,3.25 78.75,5 DIS1.2
D0  (via drill 0.61)
  Top 0.254: 44.75,52.5 47.25,55 v47.25,76 | 44.75,52.5 42.75,50.5 42.75,44 43.75,44 U$4.2 | v71.5,50.25 71.5,44 73,44 U$3.2 | 44.75,52.5 v46.75,50.5 | v53.5,77.25 53.5,93.75 EXPANSION2.3 | v31.25,79.25 25.75,79.25 U$2.11
  Bottom 0.254: v71.5,50.25 71.25,50.5 v46.75,50.5 | Z80.14 133.25,77.5 132.25,78.5 114.75,78.5 113.75,77.5 108,77.5 EXPANSION1.9 107.75,77.25 107,76.5 94,76.5 93.75,76.25 84.25,76.25 83.25,77.25 82.75,77.25 RAM_HM6116.9 82.5,77.25 82.25,77 69,77 68.25,76.25 66.25,76.25 65.25,77.25 58.5,77.25 ROM_AT28C16.9 58.25,77.25 v53.5,77.25 48.5,77.25 v47.25,76 34.5,76 v31.25,79.25
D1  (via drill 0.61)
  Top 0.254: v46.25,80 46.25,54.75 42.25,50.75 42.25,43.25 43.75,43.25 U$4.3 | v56.5,91.25 56.25,91 56.25,82.25 58.25,80.25 ROM_AT28C16.10 | v30.75,80.75 25.75,80.75 U$2.10 | v78,80 74.5,76.5 74.5,57.5 70.5,53.5 70.5,50 71,49.5 71,43.25 73,43.25 U$3.3
  Bottom 0.254: v56.5,91.25 56,91.25 56,93.75 EXPANSION2.5 | v30.75,80.75 31,80.5 41.5,80.5 42.25,81.25 45,81.25 v46.25,80 58.25,80 ROM_AT28C16.10 58.5,80.25 59,80.75 65.75,80.75 66.25,81.25 68.25,81.25 69.5,80 v78,80 82.5,80 RAM_HM6116.10 82.75,80.25 83.25,80.25 84.25,81.25 93.75,81.25 94.75,80.25 107.75,80.25 EXPANSION1.10 108,80 113.25,80 114.25,79 132.25,79 133.25,80 Z80.15
D2  (via drill 0.61)
  Top 0.254: v42,41.75 42,41.5 43.75,41.5 U$4.5 | v40,42 v40,45.5 40,76.5 40.5,77 v40.5,83.75 | v73.75,45.75 74.25,45.25 74.25,41.5 73.25,41.5 U$3.5 | v115.75,73.75 111.25,78.25 111.25,79.25 EXPANSION1.11 | EXPANSION2.7 58.25,93.75 57.5,93 57.5,86.25 56.75,85.5 56.75,84.25 58.25,82.75 ROM_AT28C16.11 | v31.5,82.5 31.5,82.25 25.75,82.25 U$2.9
  Bottom 0.254: v42,41.75 41.75,42 v40,42 | v73.75,45.75 73.5,45.5 v40,45.5 | EXPANSION1.11 107.75,82.5 95,82.5 93.75,83.75 84.25,83.75 83.25,82.75 82.75,82.75 RAM_HM6116.11 82.5,82.75 81.75,83.5 68.5,83.5 68.25,83.75 61.75,83.75 60.75,82.75 58.5,82.75 ROM_AT28C16.11 58.25,82.75 45.25,82.75 44.25,83.75 v40.5,83.75 32.75,83.75 v31.5,82.5 | v115.75,73.75 132,73.75 133.25,72.5 Z80.12
D3  (via drill 0.61)
  Top 0.254: U$4.6 43.75,40.75 41,40.75 v41,44.5 41,83 43,85 ROM_AT28C16.13 | v75.25,44.25 75.25,40.75 73.25,40.75 U$3.6 | v115.25,63.75 109.75,69.25 109.75,77.75 108.5,79 102.75,79 v102.75,83.5 | v61,84.25 61,93.75 EXPANSION2.9 | v21.75,85 21.75,84 25.5,84 U$2.8
  Bottom 0.254: v75.25,44.25 74.75,44.75 53.5,44.75 53.25,45 41.5,45 v41,44.5 | v115.25,63.75 118.75,63.75 120.25,62.25 133.25,62.25 Z80.8 | v102.75,83.5 101.25,85 92.75,85 EXPANSION1.13 92.5,85 91.75,84.25 84,84.25 83.75,84 68.75,84 67.75,85 67.5,85 RAM_HM6116.13 67.25,85 66.5,84.25 v61,84.25 59.75,84.25 59.5,84 44.75,84 43.75,85 43.25,85 ROM_AT28C16.13 43,85 v21.75,85
D4  (via drill 0.61)
  Top 0.254: 42.25,39.25 39,39.25 39,76.25 40,77.25 40,81 v39.5,81.5 | 42.25,39.25 43.75,39.25 U$4.8 | v71.5,39 73,39 U$3.8 | 42.25,39.25 v42.25,39.5 | v96.75,61 94.5,63.25 94.5,80.75 92.75,82.5 EXPANSION1.14 | v63.25,81.75 63.25,93.5 63.5,93.75 EXPANSION2.11 | v29.5,83.25 29.5,85.25 25.75,85.25 U$2.7
  Bottom 0.254: v71.5,39 71,39.5 v42.25,39.5 | EXPANSION1.14 92.5,82.5 91.75,81.75 84,81.75 83.75,81.5 68.75,81.5 67.75,82.5 67.5,82.5 RAM_HM6116.14 67.25,82.5 66.5,81.75 v63.25,81.75 59.75,81.75 59.5,81.5 45.5,81.5 44.5,82.5 43.25,82.5 ROM_AT28C16.14 43,82.5 40.5,82.5 v39.5,81.5 31.25,81.5 v29.5,83.25 | v96.75,61 119,61 120.25,59.75 133.25,59.75 Z80.7
D5  (via drill 0.61)
  Top 0.254: v43.5,35.5 42.75,36.25 42.75,37.25 43.75,37.25 U$4.10 | v71.5,35.5 72,36 72,37 72.25,37.25 73,37.25 U$3.10 | v110.25,79 110.25,71.25 123.75,71.25 130,65 133.25,65 Z80.9 | 45,86.25 45,82 43.25,80.25 ROM_AT28C16.15 | 45,86.25 45,88 v47.25,90.25 47.25,98.75 25.5,98.75 22.25,95.5 22.25,87 25.5,87 U$2.6 | v38,36.5 38,82.5 41.75,86.25 45,86.25
  Bottom 0.254: v71.5,35.5 v43.5,35.5 42.5,36.5 v38,36.5 | 66.25,79 44.25,79 43.25,80 ROM_AT28C16.15 | 66.25,79 67.25,80 RAM_HM6116.15 | 91.5,79 92.5,80 EXPANSION1.15 | 66.25,79 91.5,79 | 91.5,79 v110.25,79 | v47.25,90.25 62.5,90.25 66,93.75 EXPANSION2.13
D6  (via drill 0.61)
  Top 0.254: v45.5,33.5 45.5,35 U$4.12 | v74.75,33.5 74.75,35 U$3.12 | v113.5,78.5 122.25,78.5 133.25,67.5 Z80.10 | EXPANSION2.15 68.75,93.75 69.5,93 69.5,75 68.25,73.75 65.5,73.75 65.5,75.5 67.25,77.25 RAM_HM6116.16 | v32.5,79.5 32.5,88.25 25.75,88.25 U$2.5 | v41.25,34.5 38.5,37.25 38.5,77 v39,77.5
  Bottom 0.254: v74.75,33.5 72.25,33.5 70.75,35 47,35 v45.5,33.5 44.5,34.5 v41.25,34.5 | 66.25,78.5 44.25,78.5 43.25,77.5 ROM_AT28C16.16 43,77.5 v39,77.5 34.5,77.5 v32.5,79.5 | 66.25,78.5 67.25,77.5 RAM_HM6116.16 | 91.5,78.5 92.5,77.5 EXPANSION1.16 | 66.25,78.5 91.5,78.5 | v113.5,78.5 113,78 109.5,78 109,78.5 91.5,78.5
D7  (via drill 0.61)
  Top 0.254: v47,33.5 46.5,34 46.5,35 U$4.13 | v75.5,32.5 75.75,32.75 75.75,35 U$3.13 | v67.25,90.25 69,88.5 69,76.5 67.5,75 RAM_HM6116.17 | v33.5,75.75 33.5,89.75 25.75,89.75 U$2.4 | v68.5,34 69,34.5 69,52.75 72.25,56 v72.25,76
  Bottom 0.254: v47,33.5 48,34.5 68.5,34.5 | 68.5,34.5 70.5,34.5 72.5,32.5 v75.5,32.5 | Z80.13 133.25,75 132.25,76 94.25,76 93.25,75 92.75,75 EXPANSION1.17 92.5,75 91.75,75.75 84,75.75 83.75,76 v72.25,76 68.75,76 67.75,75 67.5,75 RAM_HM6116.17 67.25,75 66.75,75 65.75,76 57.25,76 56.25,75 43.25,75 ROM_AT28C16.17 43,75 34.25,75 v33.5,75.75 | v67.25,90.25 67.25,94.25 68.25,95.25 69.75,95.25 71,94 EXPANSION2.17 | v68.5,34 68.5,34.5
DP
  Top 0.254: R2.2 28,25.25 29,24.25 29,6.25 28,5.25 DIS5.5
  Bottom 0.254: DIS1.5 86.25,5.25 84.75,6.75 74,6.75 72.5,5.25 DIS2.5 72.25,5.25 70.75,6.75 51.75,6.75 | 26.25,6.75 16.75,6.75 15.25,5.25 DIS6.5 | 26.25,6.75 27.75,5.25 DIS5.5 | 39,6.75 40.5,5.25 DIS4.5 | 26.25,6.75 39,6.75 | 51.75,6.75 53.25,5.25 DIS3.5 | 39,6.75 51.75,6.75
E
  Top 0.254: R6.2 17.75,25.25 16.75,24.25 16.75,6.25 17.75,5.25 DIS5.1
  Bottom 0.254: DIS1.1 76,5 74.25,3.25 64,3.25 62.25,5 DIS2.1 62,5 60.25,3.25 41.25,3.25 | 16,3.25 7,3.25 5.25,5 DIS6.1 | 16,3.25 17.75,5 DIS5.1 | 28.5,3.25 30.25,5 DIS4.1 | 16,3.25 28.5,3.25 | 41.25,3.25 43,5 DIS3.1 | 28.5,3.25 41.25,3.25
EXP1!CS  (via drill 0.61)
  Top 0.254: v151.25,46.5 151.25,47.75 152.25,48.75 152.25,54 U$1.20 | v89.75,46.25 90.25,46.75 90.25,70 92.5,72.25 EXPANSION1.18 92.5,72.5 88,77 88,89.75 v86.5,91.25
  Bottom 0.254: v151.25,46.5 149.5,44.75 135.75,44.75 134.25,43.25 100.25,43.25 97,46.5 90,46.5 v89.75,46.25 | v86.5,91.25 81.25,91.25 78.75,93.75 EXPANSION2.23
F  (via drill 0.61)
  Top 0.254: v47.5,17.5 47.5,18.5 45.75,20.25 DIS3.9 | v63.25,18 63.25,18.75 64.75,20.25 DIS2.9 | 7.75,25 7.75,25.25 R4.2 | 7.75,25 7.75,20.5 DIS6.9 | 7.75,25 11.25,21.5 11.25,18.5 13,18.5 13.75,19.25 13.75,26.5 20.75,26.5 21.5,25.75 21.5,21.5 DIS5.9 20.5,20.25 20.5,19 v22,17.5 | 7.75,25 R4.2 | DIS4.9 33,20.5 32,21.5 32,27.5 27.75,31.75 7.75,31.75 7.75,25.5 R4.2
  Bottom 0.254: DIS1.9 78.5,20.25 76.75,18.5 74,18.5 73.5,18 v63.25,18 48,18 v47.5,17.5 v22,17.5
G
  Top 0.254: DIS6.10 5,20.5 5,25.25 R3.2
  Bottom 0.254: DIS1.10 76,20.25 75,20.25 73.25,18.5 64,18.5 62.25,20.25 DIS2.10 62,20.25 60.25,18.5 41.25,18.5 | 19.75,18.5 18,20.25 DIS5.10 | 28.5,18.5 19.75,18.5 | 28.5,18.5 30.25,20.25 DIS4.10 | 41.25,18.5 43,20.25 DIS3.10 | 28.5,18.5 41.25,18.5 | 19.75,18.5 7,18.5 5.25,20.25 DIS6.10
GND  (via drill 0.61)
  Top 0.254: U$3.24 84.5,37.5 v86.75,37.5 87,37.5 87,41.25 86,42.25 84.5,42.25 U$3.30 84.25,42.25 83.5,42.25 81.25,44.5 81.25,46.25 U$3.36 81.25,46.5 v81.25,52.25 | RESET.4 101.25,10.5 103,12.25 103,17.5 101.25,19.25 SHIFT.4 101.25,19.5 103,21.25 103,39.5 v101.75,40.75 102.75,41.75 102.75,50.75 C5.1 | U$3.4 73,42.25 71.75,42.25 71.75,40.5 v71.5,40.25 70.5,39.25 70.5,35.25 71.25,34.5 73,34.5 73,36.5 U$3.11 73.25,36.75 77.75,36.75 77.75,35.25 U$3.16 77.75,35 77.75,29.5 76.25,28 C9.2 | 44.5,36.75 46.5,36.75 46.5,40.75 45,42.25 44,42.25 U$4.4 | 44.5,36.75 44,36.75 U$4.11 44.5,36.75 | 47.25,32.5 48.75,34 48.75,35 U$4.16 | 47.25,32.5 44.5,32.5 44.5,36.75 | 47.25,32.5 48.5,31.25 v48.5,28.25 | 54,41.75 54,37.5 55,37.5 U$4.24 55.25,37.25 56.25,37.25 v56.25,28.75 | 54,41.75 54.5,42.25 55,42.25 U$4.30 | 54,41.75 52,43.75 52,46.25 U$4.36 52,46.5 52,52 C3.1 52,52.25 49.75,54.5 49.75,65.5 50.25,66 50.25,92.75 49.5,93.5 49.5,95.25 50.75,96.5 EXPANSION2.2 51,96.75 52,96.75 53,97.75 59.75,97.75 59.75,86.5 58.5,85.25 ROM_AT28C16.12 | C2.1 34.25,53.5 25.75,53.5 25.75,53.75 U$2.28 | U$1.16 149,54 149,50.5 146.75,48.25 IC5.1 146.5,48.25 142.25,52.5 | 143,55.5 142.25,55.5 142.25,52.5 | 143,55.5 144,55.5 U$1.11 | 142.25,52.5 142.25,48.75 C8.2 | 143,55.5 143,61.25 144,61.25 U$1.4 | 154.25,56.5 152.5,56.5 152.5,61.25 | 154.25,56.5 155.25,56.5 U$1.24 | 152.5,61.25 152.5,64.25 152.25,64.5 152.25,65.25 U$1.36 152.25,65.5 152.25,72.75 U$5.2 152.25,73 158.25,79 158.25,79.25 | 152.5,61.25 155.25,61.25 U$1.30 | U$6.GND 156,88.75 155,87.75 155,82.5 156,81.5 C10.+ 156.25,81.25 158.25,79.25
  Top 0.254: 158.25,79.25 160,77.5 160,72.75 161,71.75 JTAG2.4 | v156,53.5 154.25,55.25 154.25,56.5 | C1.- 145,91.25 149.75,86.5 149.75,81.5 DISABLE_CLK.1 | EXPANSION1.12 108,85 112.5,80.5 112.5,78.25 118,72.75 118,72.5 Z80.29 | v42,94.75 25.75,94.75 U$2.1
  Bottom 0.254: 81.25,52.5 101.25,52.5 102.75,51 C5.1 | 81.25,52.5 77.75,52.5 77.5,52.25 C4.1 | v101.75,40.75 94.5,40.75 JTAG3.4 | 81.25,52.5 v81.25,52.25 | JTAG1.4 65,40.5 65.25,40.25 v71.5,40.25 73.75,38 86.25,38 v86.75,37.5 | 56.25,27.75 76,27.75 C9.2 | 56.25,27.75 53.25,27.75 52.25,26.75 C7.2 52,26.75 50,26.75 v48.5,28.25 | C3.1 52,52.25 50.5,53.75 34.75,53.75 34.5,53.5 C2.1 | v56.25,28.75 56.25,27.75 | C6.1 123.25,98 124.25,99 137.25,99 144.75,91.5 C1.- | DISABLE_CLK.1 150,81.25 156,81.25 C10.+ | v156,53.5 151,48.5 142.25,48.5 C8.2 | 81.5,86.25 59.5,86.25 58.5,85.25 ROM_AT28C16.12 | 81.5,86.25 82.5,85.25 RAM_HM6116.12 | v42,94.75 43.75,96.5 50.75,96.5 EXPANSION2.2 | 81.5,86.25 106.75,86.25 107.75,85.25 EXPANSION1.12 | Z80.29 119.25,71.25 145.75,71.25 148.5,68.5 151,68.5 152.75,70.25 159.75,70.25 161,71.5 JTAG2.4
  pour Top: -2.2,103.6 169.8,103.6 169.8,-1.8 -2.2,-1.8
  pour Bottom: -2.1,103.5 169.2,103.5 169.2,-1 -2.1,-1
IORQ  (via drill 0.61)
  Top 0.254: U$1.40 149,65.5 149,71.25 148.75,71.5 148.75,72.75 149.75,73.75 151.25,73.75 151.25,75.25 151.5,75.5 151.5,86.5 141.75,96.25 133.5,96.25 133.5,92.75 Z80.20 | v100.75,95 100.75,97.75 96,97.75 95.25,97 95.25,95.25 92.75,95.25 91.5,94 EXPANSION2.33
  Bottom 0.254: v100.75,95 101,94.75 131.25,94.75 133.25,92.75 Z80.20
MREQ  (via drill 0.61)
  Top 0.254: v150.75,69.5 150.75,65.5 U$1.38 | v139.75,80.5 138.25,82 138.25,85.25 133.5,90 Z80.19 133.25,90.25 131.5,92 131.5,93.25 v126.25,93.25
  Bottom 0.254: v139.75,80.5 v150.75,69.5 | v126.25,93.25 124.5,91.5 117.25,91.5 116.5,92.25 95.5,92.25 94,93.75 EXPANSION2.35
N$1  (via drill 0.61)
  Top 0.254: v59.75,31.75 59.25,32.25 59.25,40.5 55.25,40.5 U$4.28 | v36.75,29.25 28,38 R2.1
  Bottom 0.254: v59.75,31.75 57.75,29.75 52,29.75 51.5,29.25 v36.75,29.25
N$2  (via drill 0.61)
  Top 0.254: v60.25,33.5 60.25,43 55.25,43 U$4.31
  Bottom 0.254: v60.25,33.5 59.25,32.5 10.75,32.5 5.25,38 R3.1
N$3  (via drill 0.61)
  Top 0.254: v54.5,58.25 54.5,45.25 55,44.75 U$4.33
  Bottom 0.254: v54.5,58.25 30,58.25 10,38.25 7.75,38.25 R4.1
N$4  (via drill 0.61)
  Top 0.254: v53,44 52.75,44.25 52.75,46.25 U$4.35
  Bottom 0.254: v53,44 50.5,41.5 43,41.5 41,39.5 30.75,39.5 28.25,37 21.5,37 20.5,38 R5.1
N$5  (via drill 0.61)
  Top 0.254: v88.5,44.25 88.5,44 84.5,44 U$3.32
  Bottom 0.254: v88.5,44.25 89.5,43.25 91.75,43.25 JTAG3.1
N$6  (via drill 0.61)
  Top 0.254: v151,71.75 151,72 150.25,72.75 U$5.1
  Bottom 0.254: v151,71.75 147.5,75.25 147.5,81.25 DISABLE_CLK.2
N$7  (via drill 0.61)
  Top 0.254: v76.25,40 73.25,40 U$3.7
  Bottom 0.254: v76.25,40 78.25,42 90.5,42 91.75,40.75 JTAG3.3
N$8  (via drill 0.61)
  Top 0.254: v53.5,52.25 53.5,46.5 U$4.34
  Bottom 0.254: v53.5,52.25 51.25,54.5 32.25,54.5 22.25,44.5 17.5,44.5 11.5,38.5 11.5,37 16.75,37 17.75,38 R6.1
N$9  (via drill 0.61)
  Top 0.254: v47.25,43.25 47.25,46.25 U$4.42
  Bottom 0.254: v47.25,43.25 47,43 30.25,43 25.5,38.25 R7.1
N$10  (via drill 0.61)
  Top 0.254: v46.25,44 46.25,46.25 U$4.43
  Bottom 0.254: v46.25,44 45.75,43.5 20.5,43.5 15.25,38.25 R8.1
N$11  (via drill 0.61)
  Top 0.254: v43.75,46.5 45.5,46.5 U$4.44
  Bottom 0.254: v43.75,46.5 25,46.5 22.5,44 18.5,44 12.75,38.25 R9.1
N$12  (via drill 0.61)
  Top 0.254: v82.75,39 84.25,39 U$3.26
  Bottom 0.254: v82.75,39 83.25,38.5 91.5,38.5 91.75,38.25 JTAG3.5
N$13  (via drill 0.61)
  Top 0.254: v72.75,50.25 72.75,45 73,44.75 U$3.1 | v95,55.5 95,44.25 95.5,43.75 95.5,39.25 94.5,38.25 JTAG3.6
  Bottom 0.254: v72.75,50.25 78,55.5 v95,55.5
N$14
  Top 0.254: JTAG2.1 157.5,73 157.5,68.5 157.75,68.25 157.75,63 155.5,63 U$1.32
N$15  (via drill 0.61)
  Top 0.254: v148.5,62.25 147.25,61 147.25,59 144.25,59 U$1.7 | v160.25,62.5 160,62.75 160,70.25 158.75,71.5 JTAG2.3
  Bottom 0.254: v148.5,62.25 148.75,62.5 v160.25,62.5
N$16
  Top 0.254: U$1.26 155.5,58 157.75,58 158,57.75 159.25,57.75 159.25,68.5 158.75,69 JTAG2.5
N$23  (via drill 0.61)
  Top 0.254: v143.75,66 143.75,64 144,63.75 U$1.1
  Bottom 0.254: v143.75,66 144.5,66.75 158.75,66.75 161,69 JTAG2.6
NMI  (via drill 0.61)
  Top 0.254: v76.5,31.75 76.5,35 U$3.14 | v89.25,33.5 90.75,35 90.75,47.5 94,50.75 94,56.25 97.75,60 97.75,95.5 96.75,96.5 EXPANSION2.38 | v125.25,95.75 125.25,92.25 126.25,92.25 133.25,85.25 Z80.17
  Bottom 0.254: v76.5,31.75 78.25,33.5 v89.25,33.5 | v125.25,95.75 101.25,95.75 101,96 100.25,96 99.5,95.25 98,95.25 96.75,96.5 EXPANSION2.38
PORT3  (via drill 0.61)
  Top 0.254: v158.25,58.75 155.5,58.75 U$1.27 | v90.25,99.5 87.75,97 87.75,95.25 86.5,94 EXPANSION2.29 | v163.75,85.5 163.75,58.25 162.75,57.25 PORT3.1
  Bottom 0.254: v158.25,58.75 159.75,57.25 162.5,57.25 PORT3.1 | v90.25,99.5 149.75,99.5 v163.75,85.5
PORT4  (via drill 0.61)
  Top 0.254: v157.5,57 157.5,57.25 155.5,57.25 U$1.25 | v84.75,87.25 84.75,93 84,93.75 EXPANSION2.27 | v164.75,77 164.25,76.5 164.25,55 162.75,53.5 PORT4.1
  Bottom 0.254: v157.5,57 161,53.5 162.5,53.5 PORT4.1 | v84.75,87.25 85.25,86.75 114.25,86.75 117,84 142.25,84 142.5,84.25 157.5,84.25 v164.75,77
PORT5  (via drill 0.61)
  Top 0.254: U$1.23 155.5,55.5 161.25,49.75 162.5,49.75 PORT5.1 | v112.75,97.75 114,99 165.75,99 165.75,52.75 v164.25,51.25
  Bottom 0.254: v112.75,97.75 112.5,97.5 110.5,97.5 110.25,97.75 92.75,97.75 92.75,96.25 91.75,95.25 82.75,95.25 81.5,94 EXPANSION2.25 | v164.25,51.25 162.75,49.75 PORT5.1
PORT6
  Top 0.254: U$1.22 154,54 162.5,45.5 PORT6.1
PORT_COLUMN  (via drill 0.61)
  Top 0.254: v52.25,17 52.25,23.5 50.25,25.5 50.25,35 U$4.18 | v160.25,18 161.25,19 164.5,19 164.5,49.75 160.25,54 v160.25,58.25 | v158.25,60 156.25,62 155.5,62 U$1.31
  Bottom 0.254: v52.25,17 53.25,16 93.25,16 93.5,16.25 158.5,16.25 v160.25,18 | v160.25,58.25 158.5,60 v158.25,60
PORT_KB  (via drill 0.61)
  Top 0.254: v79.5,44.75 79.5,46.25 U$3.38 | v140.75,63.75 v140.75,45.75 | v155,64.75 155.25,64.5 155.25,63.75 U$1.33
  Bottom 0.254: v79.5,44.75 81.5,46.75 88.5,46.75 89,47.25 115.75,47.25 117.25,45.75 v140.75,45.75 | v140.75,63.75 141.25,64.25 152.75,64.25 153.25,64.75 v155,64.75
PORT_ROW  (via drill 0.61)
  Top 0.254: v51.25,36.5 51.25,35.25 U$4.19 | v122.25,36 125.75,39.5 125.75,45 131.5,50.75 131.5,60 132.25,60.75 135.5,60.75 v135.5,59.75 | v157,59.75 155.5,59.75 U$1.28
  Bottom 0.254: v51.25,36.5 80.75,36.5 81.75,37.5 85.5,37.5 86.5,36.5 121.75,36.5 v122.25,36 | v157,59.75 v135.5,59.75
RAM!CS  (via drill 0.61)  (1 unrouted)
  Top 0.254: v152.5,25.5 152.5,38 150.25,40.25 150.25,46.75 150.5,47 150.5,54 U$1.18 | v77.75,28 v81.5,24.25 | v68.5,32 66,34.5 66,56.25 64.5,57.75 64.5,71 65.75,72.25 67.25,72.25
  Bottom 0.254: v152.5,25.5 150.5,23.5 106.25,23.5 105.5,22.75 89.25,22.75 87.75,24.25 v81.5,24.25 | v77.75,28 73.75,32 v68.5,32
ROM!CS  (via drill 0.61)
  Top 0.254: v151.25,55.75 151.25,54.25 U$1.19 | v144,49.5 143.25,48.75 v143.25,26.5 | v69.5,24.25 63.5,30.25 63.5,50 55.5,58 55.5,63 52.25,66.25 v52.25,71.25
  Bottom 0.254: v151.25,55.75 151.25,49.5 v144,49.5 | v143.25,26.5 142,25.25 80.75,25.25 80,24.5 69.75,24.5 v69.5,24.25 | v52.25,71.25 51.25,72.25 43.25,72.25 ROM_AT28C16.18
SEG0
  Top 0.254: 81.25,5.25 68.75,17.75 68.75,21 58.75,31 58.75,39.75 55.25,39.75 U$4.27 | 81.25,5.25 81.25,20.25 DIS1.8 | 81.25,5.25 DIS1.3
SEG1
  Top 0.254: U$4.25 55.25,38.25 56.75,38.25 56.75,31 67.25,20.5 DIS2.8 67.25,20.25 67.25,5.25 DIS2.3
SEG2
  Top 0.254: 48.5,15.5 52.75,15.5 55,17.75 55,36.5 U$4.23 | 48.5,15.5 48.5,20.25 DIS3.8 | 48.5,15.5 48.5,5.25 DIS3.3
SEG3
  Top 0.254: 35.75,18.5 41,18.5 41.75,19.25 41.75,22 48.75,22 49.5,21.25 49.5,16 52.5,16 54.5,18 54.5,21.25 53,22.75 53,25.5 53.5,26 53.5,35 U$4.22 | 35.75,18.5 35.75,20.25 DIS4.8 | 35.75,18.5 35.75,5.25 DIS4.3
SEG4  (via drill 0.61)
  Top 0.254: v51.25,30.25 52.75,31.75 52.75,35 U$4.21 | v27.25,30.25 23,26 23,20.5 DIS5.8 23,20.25 23,5.25 DIS5.3
  Bottom 0.254: v27.25,30.25 v51.25,30.25
SEG5  (via drill 0.61)
  Top 0.254: v51.25,31.5 51.75,32 51.75,35 U$4.20 | DIS6.3 10.25,5.25 10.25,20.25 DIS6.8
  Bottom 0.254: v51.25,31.5 51,31.25 17,31.25 10.25,24.5 10.25,20.5 DIS6.8
SHIFT  (via drill 0.61)
  Top 0.254: v87,32.5 83.25,36.25 83.25,38.25 84.25,38.25 U$3.25 | v100,30.5 101,29.5 101,24 SHIFT.2
  Bottom 0.254: v87,32.5 89,30.5 v100,30.5 | R1.1 105.25,24 101.25,24 SHIFT.2
TCK  (via drill 0.61)
  Top 0.254: v57.75,38.5 57.75,39 55.25,39 U$4.26
  Bottom 0.254: v57.75,38.5 58,38.25 62,38.25 JTAG1.5
TDI  (via drill 0.61)
  Top 0.254: v48.5,37.75 48.5,39.5 45.25,42.75 45.25,44.5 44,44.5 U$4.1
  Bottom 0.254: v48.5,37.75 48.75,37.5 61.25,37.5 61.75,37 63.75,37 64.75,38 JTAG1.6
TDO
  Top 0.254: U$4.32 55.25,43.75 62,43.75 62,43.25 JTAG1.1
TMS  (via drill 0.61)
  Top 0.254: v45.5,40.5 45.5,40 44,40 U$4.7
  Bottom 0.254: v45.5,40.5 62,40.5 JTAG1.3
VCC  (via drill 0.61)
  Top 0.254: v29.5,48.25 29.5,47.75 25.75,47.75 U$2.32 | v93,51 92.75,51.25 92.75,57 EXPANSION1.24 | v50.75,57.25 50.75,93.75 EXPANSION2.1 | v43,52.75 43,57 ROM_AT28C16.24 | C10.- 158.75,84.25 156.25,86.75 U$6.VBUS | IC5.3 146.75,43.5 149.75,40.5 149.75,39.25 R15.1 | R1.2 105.5,11.5 111.75,11.5 111.75,37 109.25,39.5 R19.1 | R16.1 139.75,39.5 139.75,69.75 R12.2 139.75,70 140.75,71 140.75,91.75 137.25,95.25 R13.1 | v98.5,39.75 98.5,50.25 98,50.75 C5.2
  Bottom 0.254: 29.5,48.5 29.25,48.5 28.5,49.25 28.5,50 28.75,50 30.75,52 43,52 | 29.5,48.5 34.25,48.5 C2.2 | 43,52 46.75,52 C3.2 47,52 48,51 52.5,51 52.75,51.25 71.5,51.25 72.25,52 C4.2 | 29.5,48.5 v29.5,48.25 | ROM_AT28C16.24 43.25,57.25 v50.75,57.25 56.25,57.25 57.25,58.25 65.75,58.25 66.75,57.25 67.25,57.25 RAM_HM6116.24 67.5,57.25 80.5,57.25 81.5,58.25 83.75,58.25 84,58 91.75,58 92.5,57.25 EXPANSION1.24 | v93,51 97.75,51 C5.2 | v43,52.75 43,52 | R10.1 114.5,97.75 121.75,97.75 122.75,96.75 127.25,96.75 128.25,97.75 C6.2 128.5,97.75 134.5,97.75 137,95.25 R13.1 137.25,95.25 142.25,90.25 145.25,90.25 146,89.5 153.5,89.5 156,87 U$6.VBUS | R14.1 114.5,69.75 115.5,68.75 132.25,68.75 Z80.11 133.5,69.75 139.5,69.75 R12.2 | R11.1 92.75,4 98,9.25 103.25,9.25 105.25,11.25 R1.2 | 118.25,40.5 110.25,40.5 109.25,39.5 R19.1 98.75,39.5 v98.5,39.75 | 118.25,40.5 119.25,39.5 R18.1 | 128.25,40.5 129.25,39.5 R17.1 | 118.25,40.5 128.25,40.5 | 138.5,40.5 139.5,39.5 R16.1 | 128.25,40.5 138.5,40.5 | 138.5,40.5 148.5,40.5 149.75,39.25 R15.1
WAIT
  Top 0.254: R10.2 114.5,85 118,85 Z80.24
X1  (via drill 0.61)
  Top 0.254: v73.75,47.5 74.75,46.5 U$3.44 | v70,46.5 69.5,46 69.5,25.5 75,20 v75,15
  Bottom 0.254: v73.75,47.5 72.75,46.5 v70,46.5 | v75,15 77.5,12.5 105.75,12.5 107.75,10.5 107.75,5.25 | 107.75,5.25 107.75,4.25 109.75,4.25 +.3 | 118.75,5.25 119.75,4.25 0.3 | 107.75,5.25 118.75,5.25 | 129,5.25 130,4.25 4.3 | 118.75,5.25 129,5.25 | 139.25,5.25 140.25,4.25 8.3 | 129,5.25 139.25,5.25 | 139.25,5.25 149.25,5.25 150.25,4.25 C.3 150.5,4 153.25,1.25 165,1.25 165,21 162.75,23.25 162.75,24 ROW.1
X2  (via drill 0.61)
  Top 0.254: v75.75,50.25 75.75,46.5 U$3.43 | v101.25,49.75 101.75,50.25 101.75,51.25 102.5,52 104.25,52 104.25,18.5 109.75,13 -.3 | ROW.2 162.5,26.5 159,23 159,8.25 158.25,7.5 152.5,7.5 152.5,10.75 150.5,12.75 D.3
  Bottom 0.254: v75.75,50.25 76.25,49.75 v101.25,49.75 | 118.75,11.75 119.75,12.75 1.3 | 118.75,11.75 111,11.75 110,12.75 -.3 | 129,11.75 130,12.75 5.3 | 118.75,11.75 129,11.75 | 139.25,11.75 140.25,12.75 9.3 | 129,11.75 139.25,11.75 | 139.25,11.75 149.25,11.75 150.25,12.75 D.3
X3  (via drill 0.61)
  Top 0.254: v76.25,42.25 76.25,46.25 U$3.42 | v70.75,41.25 70,40.5 70,31.25 v78.25,23 | ROW.3 162.5,29.25 159.5,32.25 159.5,35.25 158.25,36.5 155,36.5 155,26.5 150.5,22 E.3
  Bottom 0.254: v76.25,42.25 75.25,41.25 v70.75,41.25 | v78.25,23 78.75,22.5 88.75,22.5 89.25,22 109.75,22 GO.3 110,22 111,23 118.75,23 | 118.75,23 119.75,22 2.3 | 129,23 130,22 6.3 | 118.75,23 129,23 | 139.25,23 140.25,22 A.3 | 129,23 139.25,23 | 139.25,23 149.25,23 150.25,22 E.3
X4  (via drill 0.61)
  Top 0.254: v83.75,48.75 82,47 82,46.5 U$3.35 | v105.25,49 107.75,46.5 107.75,33 109.75,31 AD.3
  Bottom 0.254: v83.75,48.75 105,48.75 v105.25,49 | 118.75,32 119.75,31 3.3 | 118.75,32 111,32 110,31 AD.3 | 129,32 130,31 7.3 | 118.75,32 129,32 | 139.25,32 140.25,31 B.3 | 129,32 139.25,32 | 149.25,32 150.25,31 F.3 | 139.25,32 149.25,32 | 149.25,32 162.25,32 162.5,31.75 ROW.4
X5  (via drill 0.61)
  Top 0.254: v88.5,32.5 84.5,36.5 U$3.23
  Bottom 0.254: v88.5,32.5 160.75,32.5 162.5,34.25 ROW.5
X6  (via drill 0.61)
  Top 0.254: v92.25,33.5 92.25,31.5 86.25,31.5 82.75,35 U$3.22
  Bottom 0.254: v92.25,33.5 159.25,33.5 162.5,36.75 ROW.6
X7  (via drill 0.61)
  Top 0.254: v82,36.5 82,35.25 U$3.21
  Bottom 0.254: v82,36.5 84,34.5 108.25,34.5 108.75,34 158,34 160.5,36.5 160.5,39.25 162.5,39.25 ROW.7
X8  (via drill 0.61)
  Top 0.254: v79.25,32.5 79.5,32.75 79.5,35 U$3.18
  Bottom 0.254: v79.25,32.5 82.25,29.5 160.5,29.5 161.5,30.5 163.75,30.5 164.5,31.25 164.5,41.75 162.75,41.75 ROW.8
Y1  (via drill 0.61)
  Top 0.254: v84.25,45.75 84.25,46.25 82.75,46.25 U$3.34 | v96,45.5 97.5,44 v97.5,38.25 | R18.2 126.75,39.5 126.75,35.75 126.5,35.5 3.2 126.25,35.25 124.5,33.5 124.5,24.5 | 124.5,15.75 124.5,10.5 126.25,8.75 0.2 | 124.5,15.75 126.25,17.5 1.2 | 124.5,24.5 126.25,26.25 2.2 | 124.5,15.75 124.5,24.5
  Bottom 0.254: v84.25,45.75 84.75,45.25 95.75,45.25 v96,45.5 | v97.5,38.25 97.75,38 125.25,38 126.75,39.5 R18.2 | COLUMN.1 162.5,2.75 158.75,6.5 128.5,6.5 126.5,8.5 0.2
Y2  (via drill 0.61)
  Top 0.254: 134.5,15.5 134.5,10.75 136.5,8.75 4.2 | 134.5,15.5 136.5,17.5 5.2 | 134.5,15.5 134.5,24.25 136.5,26.25 6.2 136.5,26.5 134.5,28.5 134.5,33.25 136.5,35.25 7.2 136.75,35.5 136.75,39.5 | v87.5,47.75 84.5,44.75 U$3.33 | 136.75,39.5 v136.75,48 | 136.75,39.5 R17.2
  Bottom 0.254: COLUMN.2 162.5,5.25 160.75,7 138.25,7 136.75,8.5 4.2 | v87.5,47.75 87.75,48 v136.75,48
Y3  (via drill 0.61)
  Top 0.254: 144.75,15.5 144.75,10.75 146.75,8.75 8.2 | 144.75,15.5 9.2 | 144.75,15.5 144.75,24.25 146.75,26.25 A.2 146.75,26.5 144.75,28.5 144.75,33.25 146.75,35.25 B.2 147,35.5 147.25,35.75 147.25,39.25 R16.2 147.25,39.5 v144.25,42.5 | v89.75,44.25 89.75,43.25 84.5,43.25 U$3.31
  Bottom 0.254: COLUMN.3 162.5,7.5 148,7.5 147,8.5 8.2 | v89.75,44.25 90,44.5 98.25,44.5 100,42.75 141.5,42.75 141.75,42.5 v144.25,42.5
Y4  (via drill 0.61)
  Top 0.254: 155,19.5 156.75,17.75 D.2 | 155,19.5 155,24.5 156.75,26.25 E.2 157,26.5 159,28.5 159,33.25 157,35.25 F.2 | 155,19.5 155,10.5 156.75,8.75 C.2 | v86,41 86,40.75 84.5,40.75 U$3.28 | v88,40.5 89.75,38.75 v89.75,37.5
  Bottom 0.254: C.2 157,8.75 158.25,10 162.5,10 COLUMN.4 | v86,41 86.5,40.5 v88,40.5 | v89.75,37.5 90.25,37 155.25,37 | 155.25,37 156.75,35.5 F.2 | 155.25,37 155.5,37 157.5,39 R15.2
Y5  (via drill 0.61)
  Top 0.254: v86,39.75 84.5,39.75 U$3.27 | R19.2 116.75,39.5 116.75,35.75 116.5,35.5 AD.2 116.25,35.25 114.25,33.25 114.25,24.25 | 114.25,15.5 114.25,10.75 116.25,8.75 +.2 | 114.25,15.5 116.25,17.5 -.2 | 114.25,24.25 116.25,26.25 GO.2 | 114.25,15.5 114.25,24.25
  Bottom 0.254: v86,39.75 86.5,39.25 97.75,39.25 98.5,38.5 115.75,38.5 116.75,39.5 R19.2 | COLUMN.5 162.5,12.5 160.5,10.5 118.25,10.5 116.5,8.75 +.2
Y6  (via drill 0.61)
  Top 0.254: v85.75,28 81.25,32.5 81.25,35 U$3.20
  Bottom 0.254: v85.75,28 86.25,27.5 152.75,27.5 157.25,23 162.25,23 164.5,20.75 164.5,15.25 162.75,15.25 COLUMN.6
Y7
  Top 0.254: U$3.19 80.25,35 80.25,27.5 85.75,22 98.5,22 98.5,9 104.75,2.75 160.5,2.75 160.5,15.75 162.5,17.75 COLUMN.7
Y8  (via drill 0.61)
  Top 0.254: v85,18.75 85,22 80.5,22 73.75,28.75 73.75,35.5 74.25,36 74.25,36.25 76.75,36.25 77,36 77,35.25 U$3.15
  Bottom 0.254: v85,18.75 85.25,18.5 91.25,18.5 93.25,20.5 162.5,20.5 COLUMN.8

## Text on the board
tNames: A little TEChnical - BennVenn Electronics 2021
tValues: GameBoy Cart Socket / Expansion Port 3